# Altium schematic sheet МИЭМ.467999.001Э3(4).SchDoc
size 420 x 297 mm; SheetNumber: 4; SheetTotal: 4; DecimalNumber: МИЭМ.467999.001Э3
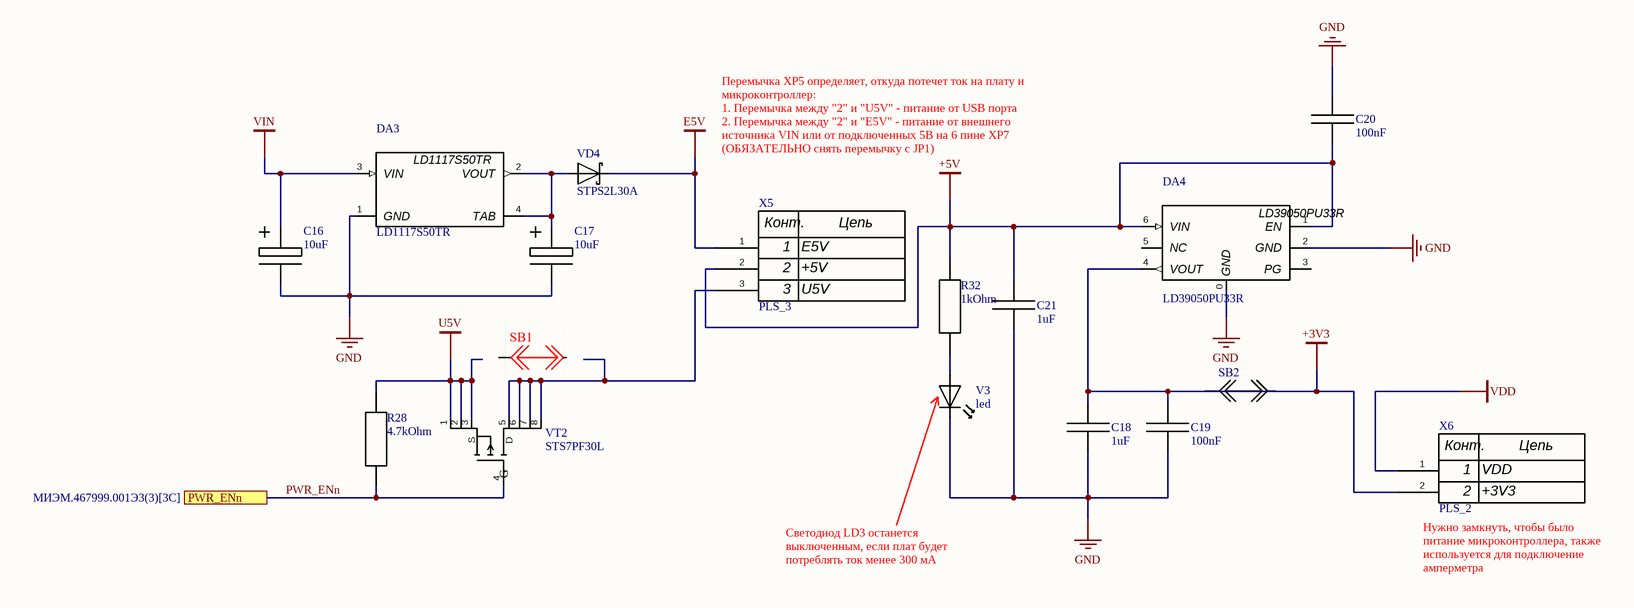
[diagram p0: МИЭМ.467999.001Э3(4).SchDoc]

## Parts
C16  10uF  [TAJB106K025R]
C17  10uF  [TAJB106K025R]
C18  1uF  [0603]
C19  100nF  [0603]
C20  100nF  [0603]
C21  1uF  [0603]
DA3  LD1117S50TR  [LD1117S50TR (SOT-223)]
DA4  LD39050PU33R  [LD39050PU33R (DFN6 (3x3 mm))]
R28  4.7kOhm  [0603]
R32  1kOhm  [0603]
V3  led  [FYLS-0603PGC]
VD4  STPS2L30A  [STPS2L30A]
VT2  STS7PF30L  [STS7PF30L]
X5  PLS_3  [PLS_3]
X6  PLS_2  [PLS_2]

## Ports
PWR_ENn (see МИЭМ.467999.001Э3(3)[3C])

## Nets
+3V3: C18.2 C19.2 DA4.4(VOUT) X6.2
+5V: C20.1 C21.2 DA4.1(EN) DA4.6(VIN) R32.2 X5.2
E5V: VD4.1 X5.1
GND: C16.2 C17.2 C18.1 C19.1 C20.2 C21.1 DA3.1(GND) DA4.0(GND) DA4.2(GND) V3.2
U5V: R28.2 VT2.1(S) VT2.2(S) VT2.3(S)
VDD: X6.1
VIN: C16.1 DA3.3(VIN)
PWR_ENn: R28.1 VT2.4(G) ; port PWR_ENn
NetC17_1: C17.1 DA3.2(VOUT) DA3.4(TAB) VD4.2
NetR32_1: R32.1 V3.1
NetVT2_5: VT2.5(D) VT2.6(D) VT2.7(D) VT2.8(D) X5.3

Not connected (* = marked no-connect by the designer): DA4 3(PG) 5(NC)

## Notes on the sheet
- Перемычка XP5 определяет, откуда потечет ток на плату и микроконтроллер:
  1. Перемычка между "2" и "U5V" - питание от USB порта
  2. Перемычка между "2" и "E5V" - питание от внешнего источника VIN или от подключенных 5В на 6 пине XP7 (ОБЯЗАТЕЛЬНО снять перемычку с JP1)
- (near X5) 1
- (near X5) E5V
- (near X5) 2
- (near X5) 3
- (near X5) +5V
- (near X5) U5V
- (near X6) 1
- (near X6) 2
- (near X6) VDD
- (near X6) +3V3
- Cветодиод LD3 останется выключенным, если плат будет потреблять ток менее 300 мА
- (near X6) Нужно замкнуть, чтобы было питание микроконтроллера, также используется для подключение амперметра
- Подп. и дата
- Инв.№ дубл.
- Взам.инв.№
- Подп.и дата
- Инв.№ подл.
- Изм.
- Лист
- № докум.
- Подп.
- Дата
- Формат  A3
- (in symbol PLS_2) Конт.; Цепь
- (in symbol PLS_3) Конт.; Цепь

## Library data of the parts
C16 C17 = Polarized Capacitor: PartNumber: TAJB106K025RNJ; Manufacturer: Kyocera AVX; VCC: 25В; Tolerance: 10%; Ta: 125℃; Value: 10uF; Package: 1411; ComponentLink1Description: Datasheet; ComponentLink1URL: *; ComponentLink2Description: Source
  C16: ComponentLink2URL: *
  C17: ComponentLink2URL: https://www.chipdip.ru/product/tajb106k025rnj-kyocera-avx-8002005515
C18 C21 = Сapacitor: PartNumber: GRM185R61A105K; Manufacturer: Murata Electronics; VCC: 10В; Tolerance: 10%; Ta: 85°C; Value: 1uF; Package: 0603; ComponentLink1Description: Datasheet; ComponentLink1URL: *; ComponentLink2Description: Source; ComponentLink2URL: https://www.chipdip.ru/product/1mkf-x5r-10v-10-0603-grm185r61a105k-kondensator-murata-767906735
C19 C20 = Сapacitor: PartNumber: CC0603KRX7R0BB104; Manufacturer: Yageo; VCC: 100В; Tolerance: 10%; Ta: 125°C; Value: 100nF; Package: 0603; ComponentLink1Description: Datasheet; ComponentLink1URL: *; ComponentLink2Description: Source; ComponentLink2URL: https://www.chipdip.ru/product/0.1mkf-x7r-100v-10-0603-cc0603krx7r0bb104-kondensator-yageo-9000578715
DA3 = LD1117S50TR: Manufacturer: STMicroelectronics; Desc: табилизатор напряжения; VCC: 15 В; Vout: 5 В; Ta: 150 °C; Package: SOT-223; ComponentLink1Description: Datasheet; ComponentLink1URL: https://static.chipdip.ru/lib/432/DOC004432359.pdf; ComponentLink2Description: Source; ComponentLink2URL: https://www.chipdip.ru/product/ld1117s50tr-stabilizator-napryazheniya-st-microelectronics-9000143564
DA4 = LD39050PU33R: Manufacturer: STMicroelectronics; Desc: Стабилизатор напряжения линейный; VCC: 5.5 В; Vout: 3.3 В; Ta: 125 °C; ComponentLink1Description: Source; ComponentLink1URL: https://www.chipdip.ru/product/ld39050pu33r-regulyator-napryazheniya-st-microelectronics-9000811056; ComponentLink2Description: Datasheet; ComponentLink2URL: https://static.chipdip.ru/lib/843/DOC012843751.pdf; Package: DFN6 (3x3 mm)
R28 = Resistor: PartNumber: RC0603JR-074K7L; Manufacturer: Yageo; VCC: 75В; Power: 0.1Вт; Ta: 155°C; Tolerance: 5%; Value: 4.7kOhm; Package: 0603; ComponentLink1Description: Datasheet; ComponentLink1URL: *; ComponentLink2Description: Source; ComponentLink2URL: https://www.chipdip.ru/product/0.1vt-0603-4.7-kom-5-rc0603jr-074k7l-chip-rezistor-yageo-9000301240
R32 = Resistor: PartNumber: RP0603DRD071KL; Manufacturer: Yageo; VCC: 50В; Power: 0.1Вт; Ta: 155°C; Tolerance: 0.5%; Value: 1kOhm; Package: 0603; ComponentLink1Description: Datasheet; ComponentLink1URL: *; ComponentLink2Description: Source; ComponentLink2URL: *
V3 = led: Manufacturer: Ningbo Foryard Optoelectronics; Desc: Диод светоизлучающий; PartNumber: FYLS-0603PGC; Package: 0603; Color: Зеленый; ComponentLink1Description: Source; ComponentLink1URL: https://www.chipdip.ru/product/fyls-0603pgc-svetodiod-smd-1-6x0-8mm-zelenyy-525nm-foryard-9000204615; Ta: *
VD4 = STPS2L30A: Manufacturer: STMicroelectronics; VCC: 30В; Desc: Диод Шоттки; Ta: 150°C; ComponentLink1Description: Source; ComponentLink1URL: https://www.chipdip.ru/product/stps2l30a-st-microelectronics-8001998231; Package: SMA; ComponentLink2Description: Datasheet; ComponentLink2URL: https://static.chipdip.ru/lib/314/DOC018314510.pdf
VT2 = STS7PF30L: Manufacturer: STMicroelectronics; VCC: 30В; Power: 2.5Вт; Ta: 150°C; Type: MOSFET; ComponentLink1Description: Source; ComponentLink1URL: https://www.chipdip.ru/product/sts7pf30l-vb-mop-tranzistor-30-v-9-a-18-m-10-p-kanal-vbsemi-8015911998; ComponentLink2Description: Datasheet; ComponentLink2URL: https://www.st.com/resource/en/datasheet/sts7pf30l.pdf; Package: SO-8; PartNumber: STS7PF30L
X5 = PLS_3: Desc: Соединение контактное; PartNumber: PLS_3
X6 = PLS_2: Desc: Соединение контактное; PartNumber: PLS_2